# Altium schematic sheet Debug.SchDoc
size A4
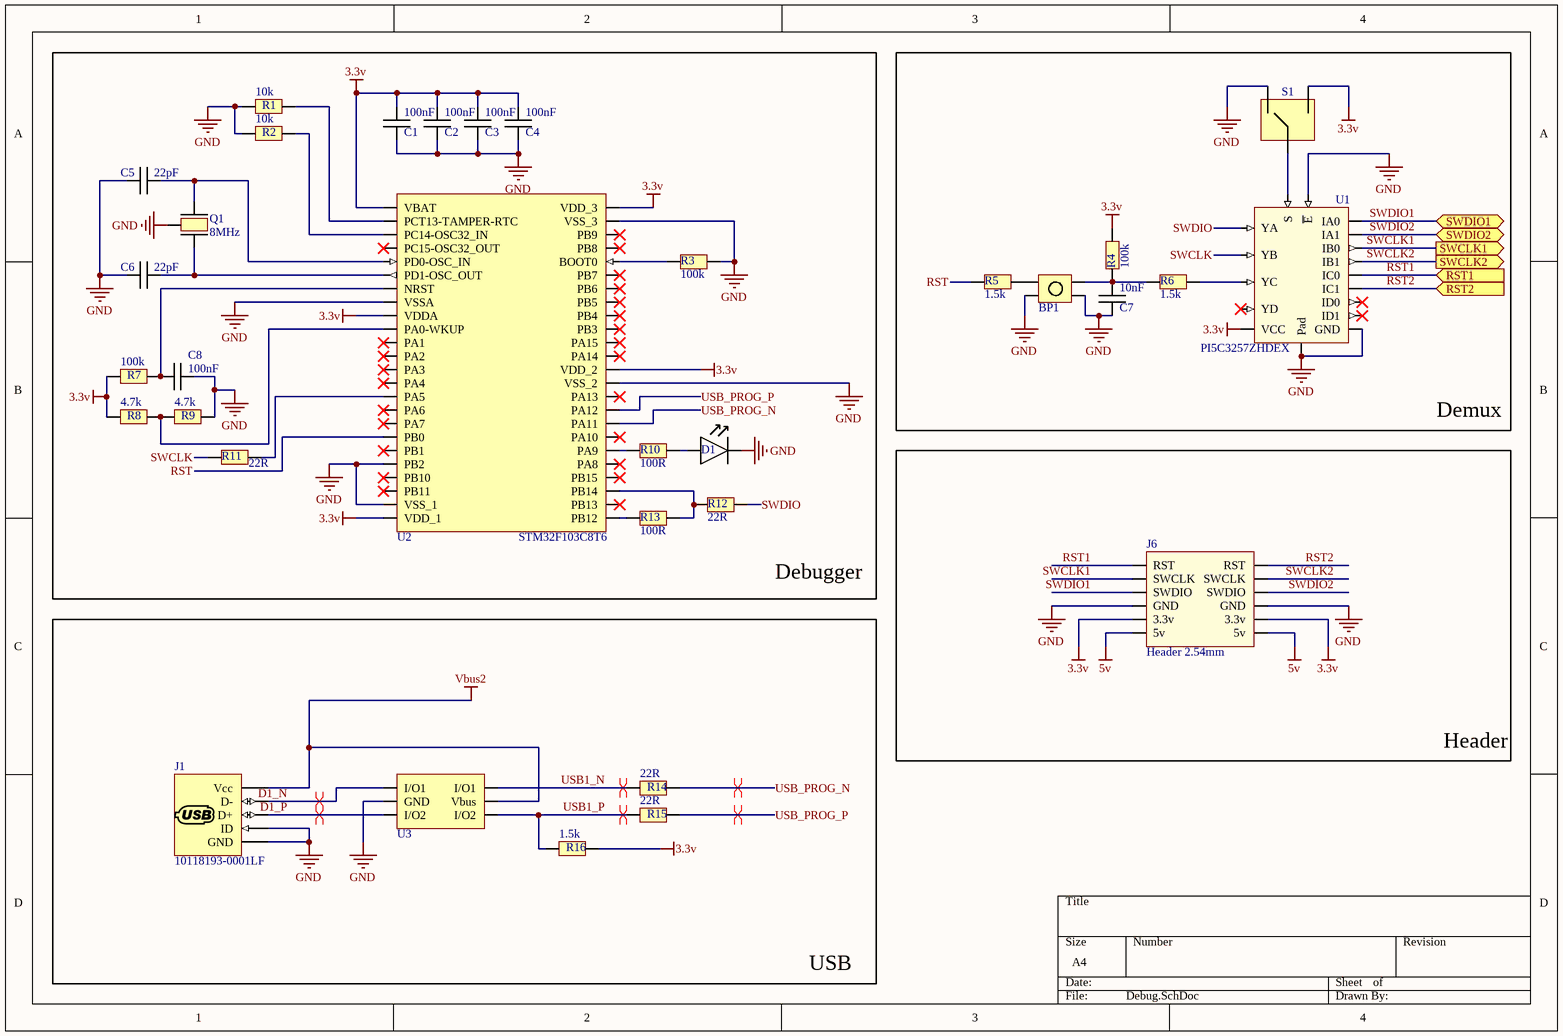
[diagram p0: Debug.SchDoc]

## Parts
BP1  BP  [BP]  (value not drawn)
C1  100nF  [0603]
C2  100nF  [0603]
C3  100nF  [0603]
C4  100nF  [0603]
C5  22pF  [0603]
C6  22pF  [0603]
C7  10nF  [0603]
C8  100nF  [0603]
D1  Led  [LED_0603]  (value not drawn)
J1  10118193-0001LF  [Mini_USB_mixte]
J6  Header 2.54mm  [Header_prog]
Q1  8MHz  [Quartz_prog]
R1  10k  [0603]
R2  10k  [0603]
R3  100k  [0603]
R4  100k  [0603]
R5  1.5k  [0603]
R6  1.5k  [0603]
R7  100k  [0603]
R8  4.7k  [0603]
R9  4.7k  [0603]
R10  100R  [0603]
R11  22R  [0603]
R12  22R  [0603]
R13  100R  [0603]
R14  22R  [0603]
R15  22R  [0603]
R16  1.5k  [0603]
S1  microswitch  [Switch_slider]  (value not drawn)
U1  PI5C3257ZHDEX  [QFN50P300X300X65_HS-17M]
U2  STM32F103C8T6  [CQFP50P900X900X160-48M]
U3  USBLC6-2P6  [SOT95P280X145-6M]  (value not drawn)

## Blocks framed on the sheet
Debugger: C1-C6 C8 D1 Q1 R1-R3 R7-R13 U2
Demux: BP1 C7 R4-R6 S1 U1
Header: J6
USB: J1 R14-R16 U3

## Ports
RST1 (in), RST2 (in), SWCLK1 (out), SWCLK2 (out), SWDIO1 (bidir), SWDIO2 (bidir)

## Nets
3.3v: C1.2 C2.2 C3.2 C4.2 J6.5(3.3v) J6.8(3.3v) R4.2 R7.1 R8.1 R16.2 S1.1(NO7) U1.16(VCC) U2.1(VBAT) U2.9(VDDA) U2.24(VDD_1) U2.36(VDD_2) U2.48(VDD_3)
5v: J6.6(5v) J6.7(5v)
GND: BP1.2(S) BP1.3(S) C1.1 C2.1 C3.1 C4.1 C5.1 C6.1 C7.1 C8.2 D1.2 J1.4(ID) J1.5(GND) J6.4(GND) J6.9(GND) Q1.3 R1.1 R2.1 R3.2 R9.2 S1.3(NO6) U1.8(GND) U1.15(~{E}) U1.17(Pad) U2.8(VSSA) U2.20(PB2) U2.23(VSS_1) U2.35(VSS_2) U2.47(VSS_3) U3.2(GND)
Vbus2: J1.1(Vcc) U3.5(Vbus)
D1_N: J1.2(D-) U3.1(I/O1)
D1_P: J1.3(D+) U3.3(I/O2)
RST: R5.2 U2.18(PB0)
RST1: J6.1(RST) U1.11(IC0) ; port RST1
RST2: J6.12(RST) U1.10(IC1) ; port RST2
SWCLK: R11.1 U1.7(YB)
SWCLK1: J6.2(SWCLK) U1.5(IB0) ; port SWCLK1
SWCLK2: J6.11(SWCLK) U1.6(IB1) ; port SWCLK2
SWDIO: R12.2 U1.4(YA)
SWDIO1: J6.3(SWDIO) U1.2(IA0) ; port SWDIO1
SWDIO2: J6.10(SWDIO) U1.3(IA1) ; port SWDIO2
USB1_N: R14.1 U3.6(I/O1)
USB1_P: R15.1 R16.1 U3.4(I/O2)
USB_PROG_N: R14.2 U2.32(PA11)
USB_PROG_P: R15.2 U2.33(PA12)
NetBP1_1: BP1.1(S) R5.1
NetBP1_4: BP1.4(S) C7.2 R4.1 R6.2
NetC5_2: C5.2 Q1.1 U2.5(PD0-OSC_IN)
NetC6_2: C6.2 Q1.2 U2.6(PD1-OSC_OUT)
NetC8_1: C8.1 R7.2 U2.7(NRST)
NetD1_1: D1.1 R10.2
NetR1_2: R1.2 U2.2(PCT13-TAMPER-RTC)
NetR2_2: R2.2 U2.3(PC14-OSC32_IN)
NetR3_1: R3.1 U2.44(BOOT0)
NetR6_1: R6.1 U1.9(YC)
NetR8_2: R8.2 R9.1 U2.10(PA0-WKUP)
NetR10_1: R10.1 U2.30(PA9)
NetR11_2: R11.2 U2.15(PA5)
NetR12_1: R12.1 R13.2 U2.27(PB14)
NetR13_1: R13.1 U2.25(PB12)
NetS1_2: S1.2(NO5) U1.1(S)

Not connected (* = marked no-connect by the designer): U1 12(YD)* 13(ID1)* 14(ID0)*; U2 4(PC15-OSC32_OUT)* 11(PA1)* 12(PA2)* 13(PA3)* 14(PA4)* 16(PA6)* 17(PA7)* 19(PB1)* 21(PB10)* 22(PB11)* 26(PB13)* 28(PB15)* 29(PA8)* 31(PA10)* 34(PA13)* 37(PA14)* 38(PA15)* 39(PB3)* 40(PB4)* 41(PB5)* 42(PB6)* 43(PB7)* 45(PB8)* 46(PB9)*

## Layout directives
differential pair; rule Differential Pairs Routing [Pref Gap = 0.25mm    Min Gap  = 0.25mm    Max Gap  = 0.25mmPref Width = 0.17mm    Min Width  = 0.17mm    Max Width  = 0.17mm]; net class USB_diff: D1_N, D1_P, USB1_N, USB1_P, USB_PROG_N, USB_PROG_P

## Library data of the parts
BP1 = BP: Manufacturer 1: Schurter; Manufacturer Part Number 1: 1241.1600.11; Mechanical Life: 1000000Cycles; Actuator Material: Polyphenylene; Current Rating: 50mA; Operating Force: 1.8N; Throw Configuration: SPST; Voltage Rating (DC): 42V; Voltage Rating (AC): 30V; Illumination Type: Non-Illuminated,Illuminated; Switch Travel: 0.35mm; Switch Function: Off-Mom; Actuator Type: Standard; Actuator Length: 1.05mm; Ratings: IP40; Supplier 1: Farnell; Stock 1: 75; Pricing 1: 1=1,74000, 50=1,68000, 100=1,27000, 500=1,09000, 1000=1,07000 (EUR); RoHS: Yes; Mount: Surface Mount; Weight: 0.059966oz; Contact Material: Gold; Contact Plating: Gold; Min Operating Temperature: -40°C; Max Operating Temperature: 85°C; Package Quantity: 100; Packaging: Bulk; Termination: Gull Wing; Max Current Rating: 50mA; Contact Current Rating: 50mA; Max Voltage Rating (DC): 42V; Max Voltage Rating (AC): 30V; Orientation: Straight; Length: 11.4mm; Depth: 15.9mm; Radiation Hardening: No; REACH SVHC: No SVHC; Flammability Rating: UL94 V-0; ComponentLink1URL: https://datasheet.ciiva.com/1223/typ-sms-1223568.pdf?src-supplier=Element14; ComponentLink1Description: https://datasheet.ciiva.com/1223/typ-sms-1223568.pdf?src-supplier=Element14; ComponentLink2URL: https://datasheet.ciiva.com/25603/0900766b81148c24-25603897.pdf?src-supplier=RSComponents; ComponentLink2Description: https://datasheet.ciiva.com/25603/0900766b81148c24-25603897.pdf?src-supplier=RSComponents; Supplier Part Number 1: 1217752
C1-C8 = Capa
D1 = Led: Manufacturer 1: Rohm; Manufacturer Part Number 1: SML-D12D8WT86C; Color: Orange; Lens Color: Colorless; Lens Style: Flat; Lens Transparency: Clear; Luminous Intensity: 100mcd; Forward Voltage: 2.2V; Test Current: 10mA; Dominant Wavelength: 605nm; Lens Size: 0.8mm; Supplier 1: Farnell; Supplier Part Number 1: 2687484; Stock 1: 9052; Pricing 1: 5=0,27600, 25=0,26700, 100=0,10800, 250=0,10100, 500=0,09420, 1000=0,05410 (EUR); RoHS: No; Mount: Surface Mount; Case/Package: 0603; Case Code (Imperial): 0603; Case Code (Metric): 1608; Packaging: Tape and Reel; Length: 1.6mm; Height: 0.65mm; Width: 0.8mm; ComponentLink1URL: http://www.farnell.com/datasheets/2186940.pdf?src-supplier=Farnell; ComponentLink1Description: http://www.farnell.com/datasheets/2186940.pdf?src-supplier=Farnell; ComponentLink2URL: https://www.rohm.com/datasheet/SML-D12D8W(C)/sml-d12x8(c)-e?src-supplier=Digi-Key; ComponentLink2Description: https://www.rohm.com/datasheet/SML-D12D8W(C)/sml-d12x8(c)-e?src-supplier=Digi-Key
J1 = 10118193-0001LF: CONN RCPT USB2.0 MICRO B SMD R/A; Manufacturer 1: Amphenol FCI; Gender: Female; Connector Type: USB,Receptacle; Number of Contacts: 5; Insulation Resistance: 1GR; Number of Ports: 1; Current Rating: 1.8A; Max Voltage Rating (AC): 100V; Pitch: 0.65mm; Supplier 1: Digi-Key; Manufacturer Part Number 1: 10118193-0001LF; Stock 1: 117828; Pricing 1: 1=0,43000, 10=0,40500, 25=0,36440, 50=0,32400, 100=0,31040, 250=0,28344, 500=0,26994 (USD); RoHS: Yes; Mount: Surface Mount,Horizontal; Contact Material: Copper Alloy; Contact Plating: Gold; Color: Black; Number of Terminals: 5; Housing Material: Polymer; Min Operating Temperature: -55°C; Max Operating Temperature: 85°C; Termination: Solder; Orientation: Right Angle; Package Quantity: 1200; Packaging: Tape and Reel; Voltage Rating: 100V; Features: Shielded; Length: 7.86mm; Depth: 5.67mm; Radiation Hardening: No; Flammability Rating: UL94 V-0; ComponentLink1URL: https://datasheet.ciiva.com/851/10118193-851106.pdf?src-supplier=Digi-Key; ComponentLink1Description: https://datasheet.ciiva.com/851/10118193-851106.pdf?src-supplier=Digi-Key; ComponentLink2URL: https://datasheet.ciiva.com/14802/10118193-0001lf-webpage-14802386.pdf?src-supplier=Arrow; ComponentLink2Description: https://datasheet.ciiva.com/14802/10118193-0001lf-webpage-14802386.pdf?src-supplier=Arrow; ComponentLink3URL: https://datasheet.ciiva.com/26853/getdatasheetpartid-418618-26853893.pdf?src-supplier=Verical; ComponentLink3Description: https://datasheet.ciiva.com/26853/getdatasheetpartid-418618-26853893.pdf?src-supplier=Verical; ComponentLink4URL: https://datasheet.ciiva.com/4598/10118193ac-197151-4598799.pdf?src-supplier=Mouser; ComponentLink4Description: https://datasheet.ciiva.com/4598/10118193ac-197151-4598799.pdf?src-supplier=Mouser; ComponentLink5URL: https://datasheet.ciiva.com/851/10118193-851107.pdf?src-supplier=Digi-Key; ComponentLink5Description: https://datasheet.ciiva.com/851/10118193-851107.pdf?src-supplier=Digi-Key; ComponentLink6URL: https://datasheet.ciiva.com/851/10118193-851108.pdf?src-supplier=Digi-Key; ComponentLink6Description: https://datasheet.ciiva.com/851/10118193-851108.pdf?src-supplier=Digi-Key; ComponentLink7URL: https://datasheet.ciiva.com/14618/70236827-14618887.pdf?src-supplier=Allied+Electronics; ComponentLink7Description: https://datasheet.ciiva.com/14618/70236827-14618887.pdf?src-supplier=Allied+Electronics; Supplier Part Number 1: 609-4616-1-ND
J6 = Header_prog: Manufacturer 1: Molex; Manufacturer Part Number 1: 90131-0126; Current Rating: 3A; Voltage Rating: 350V; Number of Positions: 12; Gender: Male; Supplier 1: Farnell; Stock 1: 578; Pricing 1: 1=1,13000, 5=1,08000, 10=0,93800, 50=0,89900, 100=0,57600, 500=0,55600, 1000=0,52900 (EUR); RoHS: Yes; Mount: Through Hole; Contact Plating: Tin; Contact Material: Brass; Housing Color: Black; Housing Material: Polyester; Min Operating Temperature: -55°C; Max Operating Temperature: 125°C; Number of Rows: 2; Packaging: Tray; Package Quantity: 2400; Termination: Solder; Number of Contacts: 12; Orientation: Straight; Lead Pitch: 2.54mm; Pitch: 2.54mm; Radiation Hardening: No; REACH SVHC: Unknown; Lead Free: Lead Free; ComponentLink1URL: https://datasheet.ciiva.com/11746/0900766b80d60386-11746641.pdf?src-supplier=RSComponents; ComponentLink1Description: https://datasheet.ciiva.com/11746/0900766b80d60386-11746641.pdf?src-supplier=RSComponents; ComponentLink2URL: https://datasheet.ciiva.com/10081/0901310126-pcb-headers-10081988.pdf?src-supplier=Avnet; ComponentLink2Description: https://datasheet.ciiva.com/10081/0901310126-pcb-headers-10081988.pdf?src-supplier=Avnet; ComponentLink3URL: https://datasheet.ciiva.com/30238/0901310126-pcb-headers-30238630.pdf?src-supplier=Onlinecomponents.com; ComponentLink3Description: https://datasheet.ciiva.com/30238/0901310126-pcb-headers-30238630.pdf?src-supplier=Onlinecomponents.com; ComponentLink4URL: https://datasheet.ciiva.com/5150/0901310126-pcb-headers-151523-5150855.pdf?src-supplier=Mouser; ComponentLink4Description: https://datasheet.ciiva.com/5150/0901310126-pcb-headers-151523-5150855.pdf?src-supplier=Mouser; ComponentLink5URL: https://datasheet.ciiva.com/16731/0901310126-pcb-headers-16731638.pdf?src-supplier=Avnet+Europe; ComponentLink5Description: https://datasheet.ciiva.com/16731/0901310126-pcb-headers-16731638.pdf?src-supplier=Avnet+Europe; ComponentLink6URL: https://datasheet.ciiva.com/26307/cgrid-iii-eng-tds-26307631.pdf?src-supplier=Distrelec; ComponentLink6Description: https://datasheet.ciiva.com/26307/cgrid-iii-eng-tds-26307631.pdf?src-supplier=Distrelec; Supplier Part Number 1: 3049397
Q1 = Quartz_8MHz: Manufacturer 1: Abracon; Manufacturer Part Number 1: ABMM2-8.000MHZ-E2-T; Frequency Tolerance: 20ppm; Load Capacitance: 18pF; ESR (Equivalent Series Resistance): 72R; Supplier 1: Farnell; Stock 1: 32000; Pricing 1: 1=0,80800, 50=0,55800, 100=0,52200, 250=0,47600, 500=0,47400, 1000=0,47100, 5000=0,46900 (EUR); RoHS: Yes; Case/Package: CSMD; Number of Pins: 4; Min Operating Temperature: -20°C; Max Operating Temperature: 70°C; Package Quantity: 1000; Frequency: 8MHz; Packaging: Tape and Reel; Frequency Stability: 20ppm; Tolerance: 20ppm; Termination: SMD/SMT; Composition: Ceramic; Series Resistance: 72R; Accuracy: 20ppm; Length: 6mm; Height: 0.047inch; Width: 3.6mm; Depth: 3.6mm; Lead Free: Lead Free; REACH SVHC: No SVHC; ComponentLink1URL: https://datasheet.ciiva.com/7998/1682206-7998656.pdf?src-supplier=Element14; ComponentLink1Description: https://datasheet.ciiva.com/7998/1682206-7998656.pdf?src-supplier=Element14; ComponentLink2URL: https://datasheet.ciiva.com/4945/abmm2-40161-4945441.pdf?src-supplier=Mouser; ComponentLink2Description: https://datasheet.ciiva.com/4945/abmm2-40161-4945441.pdf?src-supplier=Mouser; ComponentLink3URL: https://datasheet.ciiva.com/3176/abmm2-3176155.pdf?src-supplier=Avnet; ComponentLink3Description: https://datasheet.ciiva.com/3176/abmm2-3176155.pdf?src-supplier=Avnet; ComponentLink4URL: https://datasheet.ciiva.com/855/abmm2-855405.pdf?src-supplier=Digi-Key; ComponentLink4Description: https://datasheet.ciiva.com/855/abmm2-855405.pdf?src-supplier=Digi-Key; ComponentLink5URL: https://datasheet.ciiva.com/855/abmm2-855406.pdf?src-supplier=Digi-Key; ComponentLink5Description: https://datasheet.ciiva.com/855/abmm2-855406.pdf?src-supplier=Digi-Key; ComponentLink6URL: https://datasheet.ciiva.com/855/abmm2-855407.pdf?src-supplier=Digi-Key; ComponentLink6Description: https://datasheet.ciiva.com/855/abmm2-855407.pdf?src-supplier=Digi-Key; Supplier Part Number 1: 1611803
R1-R16 = Resistance
S1 = microswitch: Manufacturer 1: Nidec Copal; Manufacturer Part Number 1: CAS-120TA; Body Material: Polyphenylene; Throw Configuration: SPDT; Voltage Rating (DC): 6V; Current Rating: 100mA; Number of Positions: 2; Electrical Life: 2000Cycles; Max Voltage Rating (DC): 24V; Actuator Type: Slide (Standard); Washable: Yes; Supplier 1: Farnell; Stock 1: 273; Pricing 1: 1=0,95500, 50=0,89700, 100=0,81900, 500=0,74100, 1000=0,62100 (EUR); RoHS: Yes; Mount: Surface Mount; Contact Material: Copper Alloy; Contact Plating: Gold; Min Operating Temperature: -40°C; Max Operating Temperature: 85°C; Packaging: Tape and Reel; Termination: J-Hook; Orientation: Vertical; Length: 0.212inch; Lead Free: Lead Free; ComponentLink1URL: https://datasheet.ciiva.com/2863/cas-2863457.pdf?src-supplier=Digi-Key; ComponentLink1Description: https://datasheet.ciiva.com/2863/cas-2863457.pdf?src-supplier=Digi-Key; ComponentLink2URL: https://datasheet.ciiva.com/2863/cas-2863458.pdf?src-supplier=Digi-Key; ComponentLink2Description: https://datasheet.ciiva.com/2863/cas-2863458.pdf?src-supplier=Digi-Key; ComponentLink3URL: https://datasheet.ciiva.com/2863/cas-2863459.pdf?src-supplier=Digi-Key; ComponentLink3Description: https://datasheet.ciiva.com/2863/cas-2863459.pdf?src-supplier=Digi-Key; Supplier Part Number 1: 2854716
U1 = PI5C3257ZHDEX: Multiplexer/Demultiplexer Bus Switch 4-Channel 2: 1 16-Pin UQFN T/R; Manufacturer 1: Diodes Inc.; Supplier 1: Digi-Key; Manufacturer Part Number 1: PI5C3257ZHDEX; Stock 1: 3500; Pricing 1: 1=0,59000, 10=0,50700, 100=0,37860, 500=0,29744, 1000=0,22984 (USD); Supplier Part Number 1: PI5C3257ZHDEXDICT-ND
U2 = STM32F103C8T6: Manufacturer 1: STMicroelectronics; RAM Size: 20KB; Frequency: 72MHz; Density: 64KB; Number of Bits: 32; Max Power Dissipation: 363mW; Interface: I2C,SPI,USB,CAN,IrDA,UART,USART,LIN; Number of I/Os: 37; Number of Timers/Counters: 4; Max Supply Voltage: 3.6V; Number of PWM Channels: 1; Number of ADC Channels: 10; Min Supply Voltage: 2V; Oscillator Type: Internal; Number of Programmable I/O: 48; Data Bus Width: 32b; Memory Type: FLASH; Number of SPI Channels: 2; Watchdog Timer: Yes; Peripherals: POR,PWM,WDT,DMA,Temp Sensor,I2C; Core Architecture: ARM; Supplier 1: Farnell; Manufacturer Part Number 1: STM32F103C8T6; Stock 1: 3456; Pricing 1: 1=6,01000, 10=4,64000, 25=4,43000, 50=4,22000, 100=4,01000, 250=3,81000, 500=2,88000 (EUR); RoHS: Yes; Case/Package: LQFP; Number of Pins: 48; Min Operating Temperature: -40°C; Max Operating Temperature: 85°C; Packaging: Tray; Package Quantity: 250; Termination: SMD/SMT; Max Frequency: 72MHz; Number of I2C Channels: 2; Address Bus Width: 32b; Memory Size: 64KB; Length: 7mm; Height: 1.45mm; Width: 7.2mm; Radiation Hardening: No; REACH SVHC: No SVHC; Lead Free: Lead Free; ComponentLink1URL: https://datasheet.ciiva.com/15122/getdatasheetpartid-69880-15122076.pdf?src-supplier=Verical; ComponentLink1Description: https://datasheet.ciiva.com/15122/getdatasheetpartid-69880-15122076.pdf?src-supplier=Verical; ComponentLink2URL: https://datasheet.ciiva.com/26816/stm32f103c8t6-26816902.pdf?src-supplier=IIIC; ComponentLink2Description: https://datasheet.ciiva.com/26816/stm32f103c8t6-26816902.pdf?src-supplier=IIIC; ComponentLink3URL: https://datasheet.ciiva.com/16210/cd00161566-16210248.pdf?src-supplier=Future+Electronics; ComponentLink3Description: https://datasheet.ciiva.com/16210/cd00161566-16210248.pdf?src-supplier=Future+Electronics; ComponentLink4URL: https://datasheet.ciiva.com/14100/pustm-arm-microcont-stm32f103-en-14100508.pdf?src-supplier=Distrelec; ComponentLink4Description: https://datasheet.ciiva.com/14100/pustm-arm-microcont-stm32f103-en-14100508.pdf?src-supplier=Distrelec; ComponentLink5URL: https://datasheet.ciiva.com/8054/1730126-8054942.pdf?src-supplier=Element14; ComponentLink5Description: https://datasheet.ciiva.com/8054/1730126-8054942.pdf?src-supplier=Element14; ComponentLink6URL: https://datasheet.ciiva.com/48687/001075658-da-01-en-mcu-64kb-mem-stm32f103c8t6-lqfp-48-stm-48687589.pdf?src-supplier=Conrad; ComponentLink6Description: https://datasheet.ciiva.com/48687/001075658-da-01-en-mcu-64kb-mem-stm32f103c8t6-lqfp-48-stm-48687589.pdf?src-supplier=Conrad; Supplier Part Number 1: 1447637
U3 = USBLC6-2P6: TVS DIODE 5.25V 17V SOT666; Manufacturer 1: STMicroelectronics; Direction: Unidirectional,Bidirectional; Operating Supply Voltage: 5V; Number of Elements: 1; Capacitance: 3.5pF; Reverse Breakdown Voltage: 6V; Number of Channels: 2; Power Line Protection: Yes; Test Current: 1mA; Max Reverse Leakage Current: 150nA; Peak Pulse Current: 5A; Element Configuration: Dual; Supplier 1: Farnell; Manufacturer Part Number 1: USBLC6-2P6; Stock 1: 22255; Pricing 1: 5=0,45800, 50=0,40500, 100=0,24700, 500=0,19100, 1500=0,17700 (EUR); RoHS: Yes; Mount: Surface Mount; Case/Package: SOT-666; Number of Pins: 6; Contact Plating: Tin,Matte; Min Operating Temperature: -40°C; Max Operating Temperature: 125°C; Package Quantity: 1; Packaging: Tape and Reel; Number of Bidirectional Channels: 2; Reverse Standoff Voltage: 5V; Min Breakdown Voltage: 6V; Clamping Voltage: 17V; Polarity: Unidirectional,Bidirectional; Breakdown Voltage: 6V; Termination: SMD/SMT; Working Voltage: 5V; ESD Protection: Yes; Leakage Current: 150nA; Max Breakdown Voltage: 6V; Length: 1.7mm; Height: 0.6mm; Width: 1.3mm; Depth: 1.3mm; Radiation Hardening: No; REACH SVHC: No SVHC; Lead Free: Lead Free; ComponentLink1URL: https://datasheet.ciiva.com/15143/getdatasheetpartid-98673-15143462.pdf?src-supplier=Verical; ComponentLink1Description: https://datasheet.ciiva.com/15143/getdatasheetpartid-98673-15143462.pdf?src-supplier=Verical; ComponentLink2URL: https://datasheet.ciiva.com/14186/usblc6-2-st-eng-tds-14186568.pdf?src-supplier=Distrelec; ComponentLink2Description: https://datasheet.ciiva.com/14186/usblc6-2-st-eng-tds-14186568.pdf?src-supplier=Distrelec; ComponentLink3URL: https://datasheet.ciiva.com/22692/1690354-22692453.pdf?src-supplier=Element14; ComponentLink3Description: https://datasheet.ciiva.com/22692/1690354-22692453.pdf?src-supplier=Element14; ComponentLink4URL: https://datasheet.ciiva.com/22685/1690354-22685832.pdf?src-supplier=Element14; ComponentLink4Description: https://datasheet.ciiva.com/22685/1690354-22685832.pdf?src-supplier=Element14; ComponentLink5URL: https://datasheet.ciiva.com/16378/cd00050750-16378714.pdf?src-supplier=Future+Electronics; ComponentLink5Description: https://datasheet.ciiva.com/16378/cd00050750-16378714.pdf?src-supplier=Future+Electronics; ComponentLink6URL: https://datasheet.ciiva.com/4508/cd00050750-4508892.pdf?src-supplier=Mouser; ComponentLink6Description: https://datasheet.ciiva.com/4508/cd00050750-4508892.pdf?src-supplier=Mouser; ComponentLink7URL: https://datasheet.ciiva.com/41444/001184108-da-01-en-ic-esd-protection-usblc6-2p6-sot-666-stm-41444134.pdf?src-supplier=Conrad; ComponentLink7Description: https://datasheet.ciiva.com/41444/001184108-da-01-en-ic-esd-protection-usblc6-2p6-sot-666-stm-41444134.pdf?src-supplier=Conrad; Supplier Part Number 1: 1295310